# EAGLE design Qwiic_Chirp_101 (EAGLE 9.6.2)
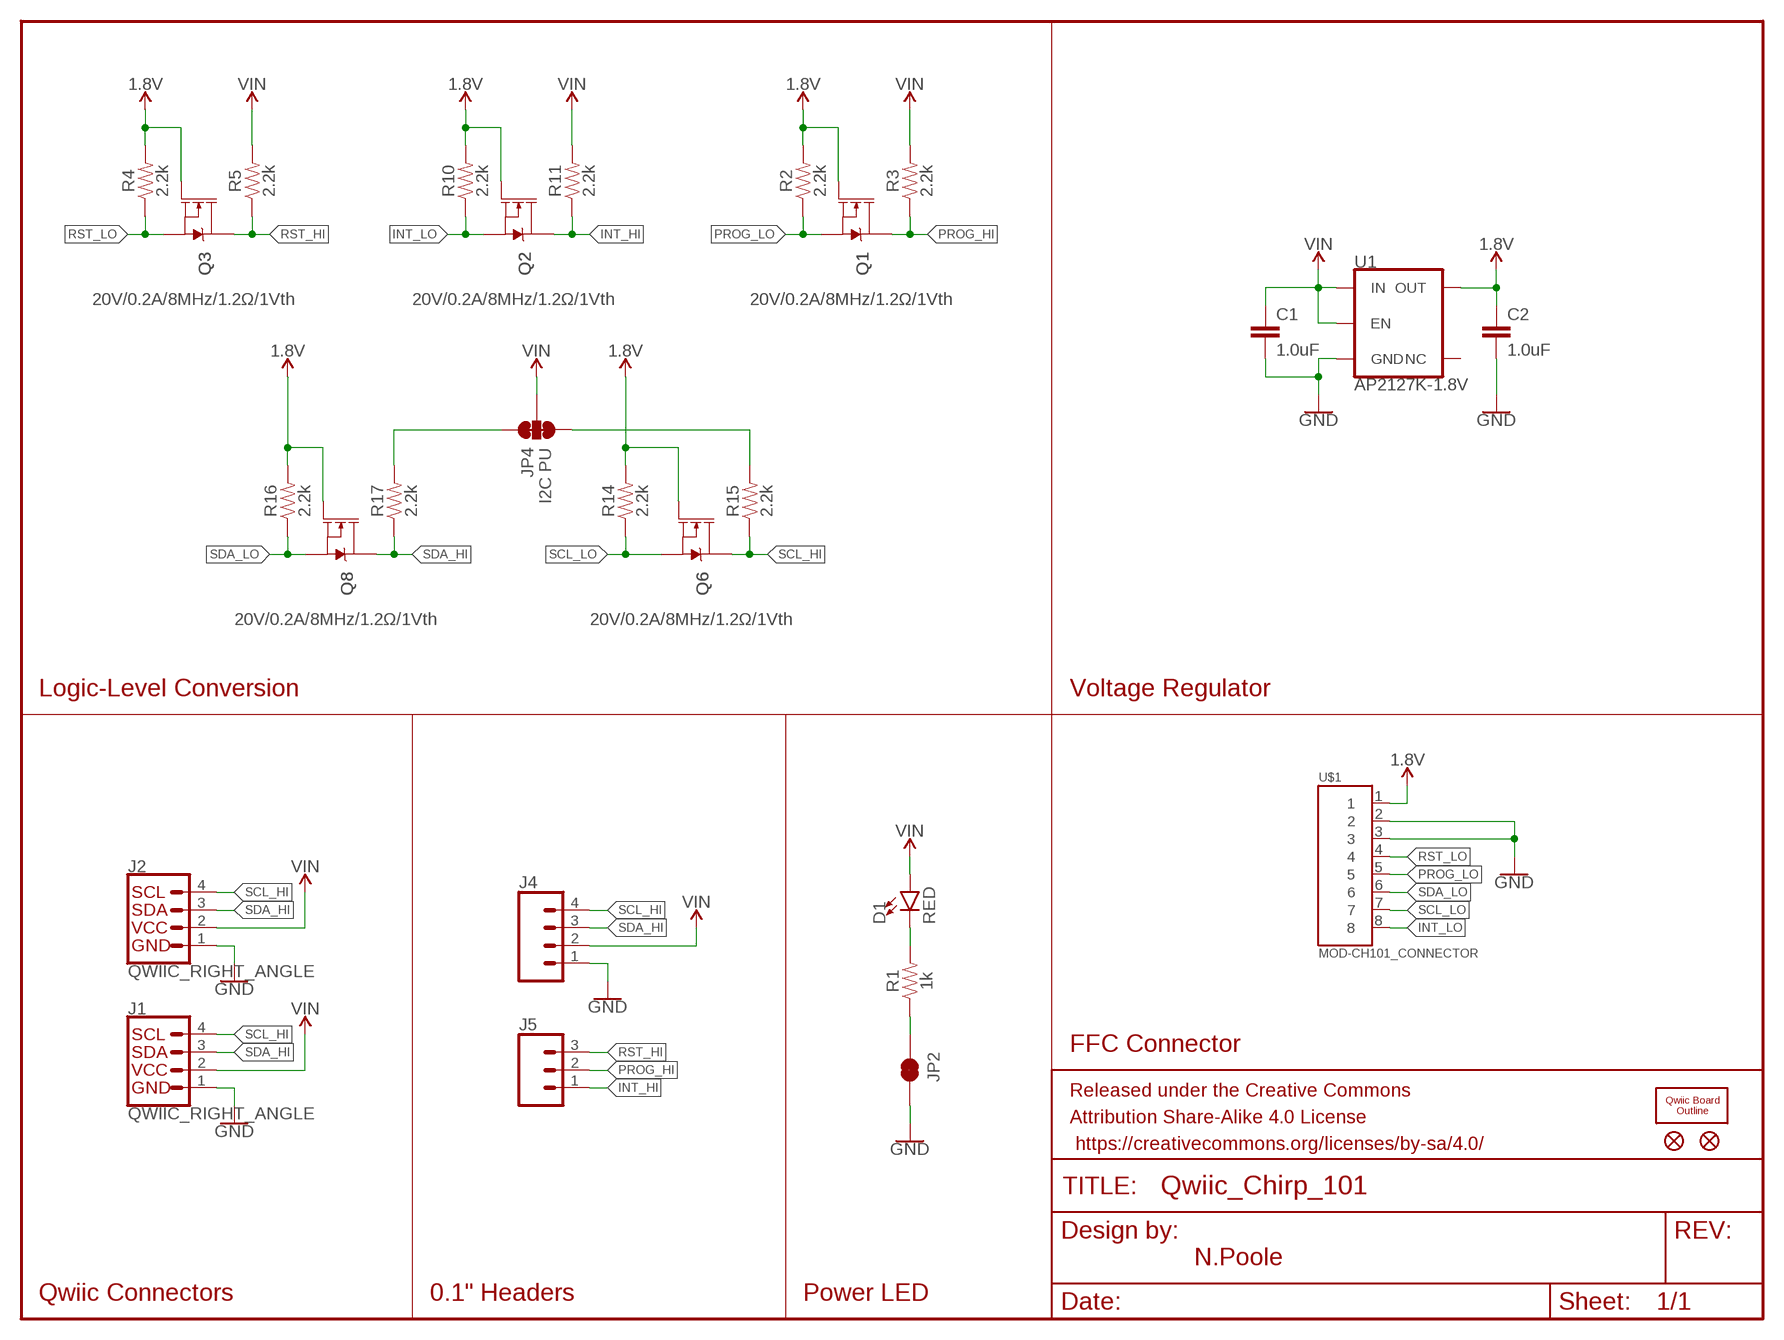
[diagram p0: schematic, sheet 1]

## Parts
C1  1.0uF  1.0UF-0603-16V-10%  [0603]
C2  1.0uF  1.0UF-0603-16V-10%  [0603]
D1  RED  LED-RED0603  [LED-0603]
FD1  FIDUCIALUFIDUCIAL  [FIDUCIAL-MICRO]
FD2  FIDUCIALUFIDUCIAL  [FIDUCIAL-MICRO]
FRAME1  FRAME-LETTERNO_PACKAGE  [DUMMY]
J1  QWIIC_RIGHT_ANGLE  QWIIC_CONNECTORJS-1MM  [JST04_1MM_RA]
J2  QWIIC_RIGHT_ANGLE  QWIIC_CONNECTORJS-1MM  [JST04_1MM_RA]
J4  CONN_041X04_NO_SILK  [1X04_NO_SILK]
J5  CONN_031X03_NO_SILK  [1X03_NO_SILK]
JP2  JUMPER-SMT_2_NC_TRACE_SILK  [SMT-JUMPER_2_NC_TRACE_SILK]
JP4  I2C PU  JUMPER-SMT_3_2-NC_TRACE_SILK  [SMT-JUMPER_3_2-NC_TRACE_SILK]
Q1  20V/0.2A/8MHz/1.2Ω/1Vth  MOSFET-NCH-RE1C002UN  [SOT-416FL]
Q2  20V/0.2A/8MHz/1.2Ω/1Vth  MOSFET-NCH-RE1C002UN  [SOT-416FL]
Q3  20V/0.2A/8MHz/1.2Ω/1Vth  MOSFET-NCH-RE1C002UN  [SOT-416FL]
Q6  20V/0.2A/8MHz/1.2Ω/1Vth  MOSFET-NCH-RE1C002UN  [SOT-416FL]
Q8  20V/0.2A/8MHz/1.2Ω/1Vth  MOSFET-NCH-RE1C002UN  [SOT-416FL]
R1  1k  1KOHM-0603-1/10W-1%  [0603]
R2  2.2k  2.2KOHM-0402T-1/16W-1%  [0402-TIGHT]
R3  2.2k  2.2KOHM-0402T-1/16W-1%  [0402-TIGHT]
R4  2.2k  2.2KOHM-0402T-1/16W-1%  [0402-TIGHT]
R5  2.2k  2.2KOHM-0402T-1/16W-1%  [0402-TIGHT]
R10  2.2k  2.2KOHM-0402T-1/16W-1%  [0402-TIGHT]
R11  2.2k  2.2KOHM-0402T-1/16W-1%  [0402-TIGHT]
R14  2.2k  2.2KOHM-0402T-1/16W-1%  [0402-TIGHT]
R15  2.2k  2.2KOHM-0402T-1/16W-1%  [0402-TIGHT]
R16  2.2k  2.2KOHM-0402T-1/16W-1%  [0402-TIGHT]
R17  2.2k  2.2KOHM-0402T-1/16W-1%  [0402-TIGHT]
U1  AP2127K-1.8V  V_REG_AP2127K-1.8V  [SOT23-5]
U$1  MOD-CH101_CONNECTOR  [FPC_MOLEX5034800800]
U$2  QWIIC_BOARD_OUTLINEH  [QWIIC_BOARD_MOUNT_HOLES]

## Nets
1.8V: C2.1 Q1.1(G) Q2.1(G) Q3.1(G) Q6.1(G) Q8.1(G) R2.2 R4.2 R10.2 R14.2 R16.2 U1.5(OUT) U$1.1
GND: C1.2 C2.2 J1.1 J2.1 J4.1 JP2.2 U1.2(GND) U$1.2 U$1.3
INT_HI: J5.1 Q2.3(D) R11.1
INT_LO: Q2.2(S) R10.1 U$1.8
N$1: D1.C R1.2
N$2: JP4.3 R15.2
N$3: JP4.1 R17.2
N$4: JP2.1 R1.1
PROG_HI: J5.2 Q1.3(D) R3.1
PROG_LO: Q1.2(S) R2.1 U$1.5
RST_HI: J5.3 Q3.3(D) R5.1
RST_LO: Q3.2(S) R4.1 U$1.4
SCL_HI: J1.4 J2.4 J4.4 Q6.3(D) R15.1
SCL_LO: Q6.2(S) R14.1 U$1.7
SDA_HI: J1.3 J2.3 J4.3 Q8.3(D) R17.1
SDA_LO: Q8.2(S) R16.1 U$1.6
VIN: C1.1 D1.A J1.2 J2.2 J4.2 JP4.2 R3.2 R5.2 R11.2 U1.1(IN) U1.3(EN)
Unconnected: U1.4(NC)

## Notes on the sheet
- Logic-Level Conversion | Voltage Regulator
- FFC Connector
- N.Poole
- Qwiic Connectors | 0.1" Headers | Power LED

## Library data of the parts
C1 C2 = SparkFun-Capacitors:1.0UF: 1µF ceramic capacitors A capacitor is a passive two-terminal electrical component used to store electrical energy temporarily in an electric field.; PROD_ID: CAP-00868
D1 = SparkFun-LED:LED-RED: Red SMD LED Used in manufacturing of most products at SparkFun Packages: 0603 - SMD 0603 package [Product Link] <http://docs.avagotech.com/docs/AV02-0551EN> 0603 SMART - SMD 0603 SMART package ( more efficient and expensive)[Product Link] <http://www.osram-os.com/Graphics/XPic2/00077099_0.pdf> 1206 - SMD1206 package [Product Link] <https://www.sparkfun.com/datasheets/DevTools/LilyPad/Q150OVS4.pdff> SparkFun Products: Pro Mini 328 -5V <https://www.sparkfun.com/products/821> RedBoard <https://www.sparkfun.com/products/12757> IOIO-OTG <https://www.sparkfun.com/products/13613>; PROD_ID: DIO-00819
FD1 FD2 = SparkFun-Aesthetics:FIDUCIAL: Fiducial Alignment Points Point-of-reference for pick-and-place machines and other optical instruments.
FRAME1 = SparkFun-Aesthetics:FRAME-LETTER: Schematic Frame - Letter Standard 8.5x11 US Letter frame; DESIGNER: Nobody; VERSION: v01
J1 J2 = SparkFun-Connectors:QWIIC_CONNECTOR: SparkFun I2C Standard Qwiic Connector An SMD 1mm pitch JST connector makes it easy and quick (get it? Qwiic?) to connect I2C devices to each other. The Qwiic system <http://www.sparkfun.com/qwiic> enables fast and solderless connection between popular platforms and various sensors and actuators. We carry 200mm <https://www.sparkfun.com/products/14204>, 100mm <https://www.sparkfun.com/products/14205>, 50mm <https://www.sparkfun.com/products/14206>, and breadboard friendly <https://www.sparkfun.com/products/14207> Qwiic cables. We also offer 10 pcs strips <https://www.sparkfun.com/products/14323> the SMD connectors.; PROD_ID: CONN-13694
J4 = SparkFun-Connectors:CONN_04: Multi connection point. Often used as Generic Header-pin footprint for 0.1 inch spaced/style header connections On any of the 0.1 inch spaced packages, you can populate with these: Break Away Headers - Straight <https://www.sparkfun.com/products/116> (PRT-00116) Break Away Male Headers - Right Angle <https://www.sparkfun.com/products/553> (PRT-00553) Female Headers <https://www.sparkfun.com/products/115> (PRT-00115) Break Away Headers - Machine Pin <https://www.sparkfun.com/products/117> (PRT-00117) Break Away Female Headers - Swiss Machine Pin <https://www.sparkfun.com/products/743> (PRT-00743) For SCREWTERMINALS and SPRING TERMINALS visit here: Screw Terimnals on SparkFun.com <https://www.sparkfun.com/search/results?term=Screw+Terminals> (5mm/3.5mm/2.54mm spacing) This device is also useful as a general connection point to wire up your design to another part of your project. Our various solder wires solder well into these plated through hole pads. Hook-Up Wire - Assortment (Stranded, 22 AWG) <https://www.sparkfun.com/products/11375> (PRT-11375) Hook-Up Wire - Assortment (Solid Core, 22 AWG) <https://www.sparkfun.com/products/11367> (PRT-11367) View the entire wire category on our website here <https://www.sparkfun.com/categories/141> Special notes: Molex polarized connector foot print use with SKU : PRT-08231 with associated crimp pins and housings. 1MM SMD Version SKU: PRT-10208; PROD_ID: CONN-09696
J5 = SparkFun-Connectors:CONN_03: Multi connection point. Often used as Generic Header-pin footprint for 0.1 inch spaced/style header connections On any of the 0.1 inch spaced packages, you can populate with these: Break Away Headers - Straight <https://www.sparkfun.com/products/116> (PRT-00116) Break Away Male Headers - Right Angle <https://www.sparkfun.com/products/553> (PRT-00553) Female Headers <https://www.sparkfun.com/products/115> (PRT-00115) Break Away Headers - Machine Pin <https://www.sparkfun.com/products/117> (PRT-00117) Break Away Female Headers - Swiss Machine Pin <https://www.sparkfun.com/products/743> (PRT-00743) Stackable Header - 3 Pin (Female, 0.1") <https://www.sparkfun.com/products/13875> (PRT-13875) For SCREWTERMINALS and SPRING TERMINALS visit here: Screw Terimnals on SparkFun.com <https://www.sparkfun.com/search/results?term=Screw+Terminals> (5mm/3.5mm/2.54mm spacing) This device is also useful as a general connection point to wire up your design to another part of your project. Our various solder wires solder well into these plated through hole pads. Hook-Up Wire - Assortment (Stranded, 22 AWG) <https://www.sparkfun.com/products/11375> (PRT-11375) Hook-Up Wire - Assortment (Solid Core, 22 AWG) <https://www.sparkfun.com/products/11367> (PRT-11367) View the entire wire category on our website here <https://www.sparkfun.com/categories/141> Special notes: Molex polarized connector foot print use with SKU : PRT-08232 with associated crimp pins and housings.
JP2 = SparkFun-Jumpers:JUMPER-SMT_2_NC_TRACE: Normally closed trace jumper This jumper has a trace between two pads so it's normally closed (NC). Use a razor knife to open the connection. For best results follow the IPC guidelines for cutting traces: Cutout at least 0.063 mm (0.005 in). Remove all loose material to clean up the cut area. Seal the cut with an approved epoxy. Reapply solder to reclose the connection.
JP4 = SparkFun-Jumpers:JUMPER-SMT_3_2-NC_TRACE: Normally closed trace jumper (2 of 2 connections) This jumper has a trace between all three pads so they are normally closed (NC). Use a razor knife to open the connection(s). For best results follow the IPC guidelines for cutting traces: Cutout at least 0.063 mm (0.005 in). Remove all loose material to clean up the cut area. Seal the cut with an approved epoxy. Reapply solder to reclose the connection(s).
Q1-Q3 Q6 Q8 = SparkFun-DiscreteSemi:MOSFET-NCH: N-channel MOSFETs Voltage controlled devices that allow control of high current outputs. SparkFun Products: SparkFun OpenScale <https://www.sparkfun.com/products/13261> SparkFun Digital Sandbox <https://www.sparkfun.com/products/12651> SparkFun Monster Moto Shield <https://www.sparkfun.com/products/10182> SparkFun MOSFET Power Controller <https://www.sparkfun.com/products/11214>; PROD_ID: TRANS_14399
R1 = SparkFun-Resistors:1KOHM: 1kΩ resistor A resistor is a passive two-terminal electrical component that implements electrical resistance as a circuit element. Resistors act to reduce current flow, and, at the same time, act to lower voltage levels within circuits. - Wikipedia; PROD_ID: RES-07856
R2-R5 R10 R11 R14-R17 = SparkFun-Resistors:2.2KOHM: 2.2kΩ resistor A resistor is a passive two-terminal electrical component that implements electrical resistance as a circuit element. Resistors act to reduce current flow, and, at the same time, act to lower voltage levels within circuits. - Wikipedia; PROD_ID: RES-14341
U1 = SparkFun-IC-Power:V_REG_AP2127: AP2127 - 300mA CMOS LDO Regulator w/ Enable The AP2127 is CMOS process low dropout linear regulator with enable function, the regulator delivers a guaranteed 300mA (min.) continuous load current. Features Output Voltage Accuracy: ±1.5% Output Current: 300mA (Min.) Foldback Short Current Protection: 50mA Enable Function to Turn ON/OFF VOUT Low Dropout Voltage (3.3V): 250mV (Typ.) @IOUT=600mA Excellent Load Regulation: 0.2%/A (Typ.) Excellent Line Regulation: 0.02%/V (Typ.) Low Quiescent Current: 55μA (Typ.) Low Standby Current: 0.01μA (Typ.) Low Output Noise: 50μVRMS PSRR: 100Hz -65dB, 1kHz -65dB OTSD Protection Stable with 1.0μF Flexible Cap: Ceramic, Tantalum and Aluminum Electrolytic Operation Temperature Range: -40°C to 85°C ESD: MM 400V, HBM 4000V; PROD_ID: VREG-14239
U$1 = SparkFun-Connectors:MOD-CH101_CONNECTOR
U$2 = SparkFun-Boards:QWIIC_BOARD_OUTLINE: Standard Outline of a Qwiic Board. Good for defining a spot on shields and board areas in which to mount a Qwiic Board.

## Board
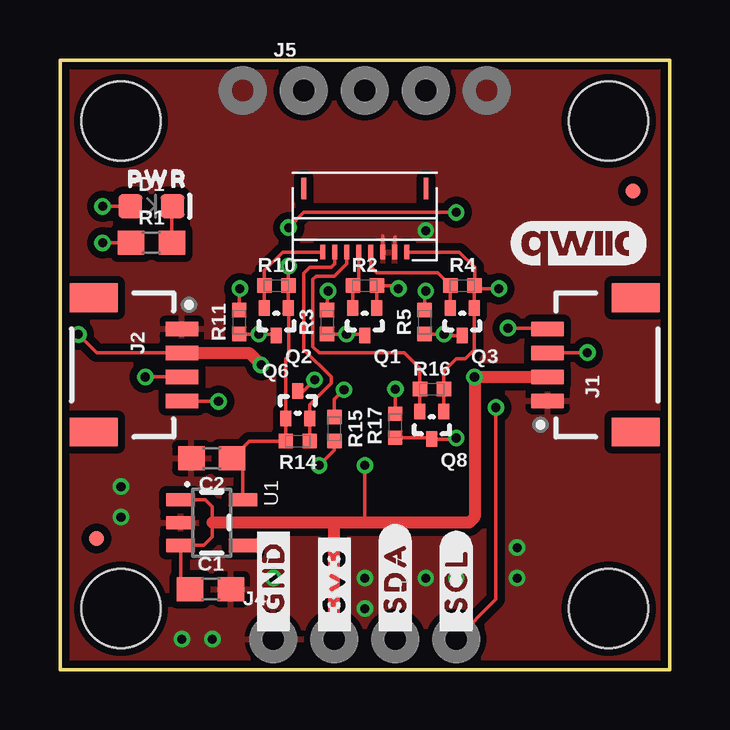
[diagram p1: board, top side]
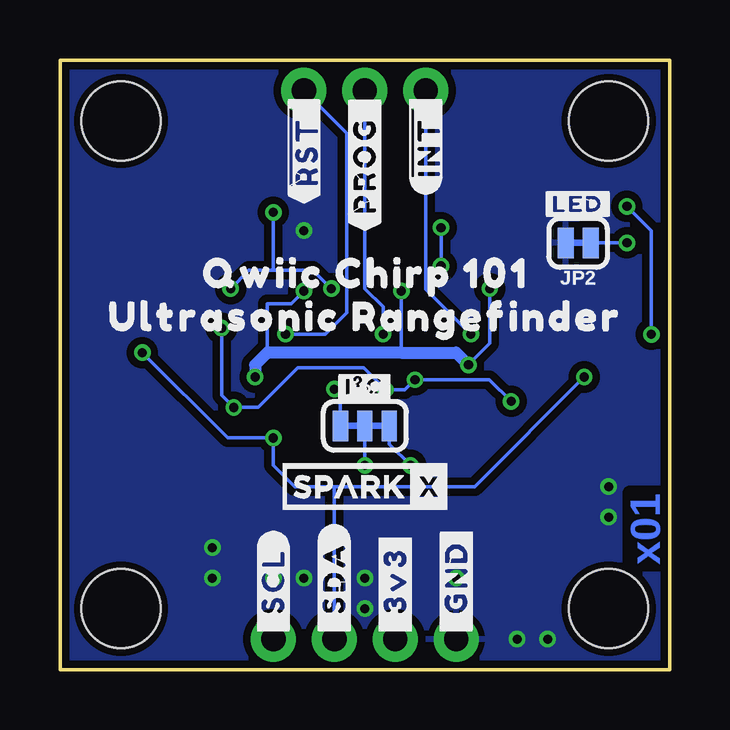
[diagram p2: board, bottom side, seen from below]

Size 25.4 x 25.4 mm. Coordinates in mm from the lower left corner, seen from the top.
Outline: 0,0 25.4,0 25.4,25.4 0,25.4 0,0
Copper layers (1*16): Top 0.035mm / dielectric 1.5mm / Bottom 0.035mm
Design rules "SparkFun-2-layer-PCBWay-LIMIT": minimum track width 6mil, minimum drill 0.3mm, track to track 6mil, track to pad 6mil, pad to pad 6mil, via to via 6mil, smd to smd 6mil, copper to edge 6mil, drill to drill 6mil, minimum pad ring 6mil, minimum via ring 6mil, stop-mask expansion 4mil, vias tented up to drill 25mil, thermal gap 10mil

### Footprints (pad centres in the part's own frame; a part is rotated, then mirrored left to right if it is on the bottom)
0603 = smd 1.1 x 1: 1 -0.85,0; 2 0.85,0
LED-0603 = smd 1 x 1: A -0.877,0; C 0.877,0
FIDUCIAL-MICRO = smd 0.635 x 0.635: 1 0,0
JST04_1MM_RA = smd 0.6 x 1.35: 1 -1.5,0; 2 -0.5,0; 3 0.5,0; 4 1.5,0 | smd 1.2 x 2: NC1 2.8,-3.675; NC2 -2.8,-3.675
1X04_NO_SILK = drill 1.016 pad 1.88: 1 0,0; 2 2.54,0; 3 5.08,0; 4 7.62,0
1X03_NO_SILK = drill 1.016 pad 1.88: 1 0,0; 2 2.54,0; 3 5.08,0
SMT-JUMPER_2_NC_TRACE_SILK = smd 0.66 x 1.27: 1 -0.521,0; 2 0.521,0
SMT-JUMPER_3_2-NC_TRACE_SILK = smd 0.635 x 1.27: 1 -1.016,0; 2 0,0; 3 1.016,0
SOT-416FL = smd 0.46 x 0.65: 1 -0.5,-1.1; 2 0.5,-1.1; 3 0,0.05
0402-TIGHT = smd 0.6 x 0.6: 1 -0.5,0; 2 0.5,0
SOT23-5 = smd 0.55 x 1.2: 1 -0.95,-1.3; 2 0,-1.3; 3 0.95,-1.3; 4 0.95,1.3; 5 -0.95,1.3
FPC_MOLEX5034800800 = smd 0.2 x 0.6: 1 -1.75,1.65; 2 -1.25,1.65; 3 -0.75,1.65; 4 -0.25,1.65; 5 0.25,1.65; 6 0.75,1.65; 7 1.25,1.65; 8 1.75,1.65 | smd 0.2 x 0.9: MNT1 -2.55,-1; MNT2 2.55,-1
QWIIC_BOARD_MOUNT_HOLES = hole 3.302: -10.16,10.16; 10.16,10.16; 10.16,-10.16; -10.16,-10.16

### Placement (x,y rotation side)
C1  6.27,3.35 0 top
C2  6.32,8.81 180 top
D1  3.81,19.3 0 top
FD1  1.52,5.46 0 top
FD2  23.88,19.94 0 top
FRAME1  0,0 0 top
J1  20.32,12.7 90 top
J2  5.08,12.7 270 top
J4  8.89,1.27 0 top
J5  10.16,24.13 0 top
JP2  3.81,17.78 180 bottom
JP4  12.7,10.16 0 bottom
Q1  12.7,13.97 180 top
Q2  9.02,13.97 180 top
Q3  16.76,13.97 180 top
Q6  9.91,11.56 0 top
Q8  15.49,9.65 180 top
R1  3.81,17.78 0 top
R2  12.7,16 0 top
R3  11.13,14.48 90 top
R4  16.76,16 0 top
R5  15.19,14.48 90 top
R10  9.02,16 0 top
R11  7.47,14.48 90 top
R14  9.91,9.53 180 top
R15  11.43,10.03 270 top
R16  15.49,11.68 0 top
R17  13.97,10.16 90 top
U1  6.32,6.12 270 top
U$1  12.7,19.05 180 top
U$2  12.7,12.7 0 top
U$3  [#_3V3#1]  11.43,1.27 90 top
U$4  [#_GND#0]  8.89,1.27 90 top
U$5  [#_SDA#2]  13.97,1.27 90 top
U$6  [#_SCL#3]  16.51,1.27 90 top
U$7  [QWIIC_CHIRP_1017]  20.32,16.51 0 bottom
U$8  [ULTRASONIC_RANGEFINDER8]  24.26,14.71 0 bottom
U$9  [#I�C#1019]  14.05,11.79 0 bottom
U$10  [#LED#1018]  5.41,19.41 0 bottom
U$11  [#_SCL#3]  16.51,1.27 90 bottom
U$12  [#_SDA#2]  13.97,1.27 90 bottom
U$13  [#_3V3#1]  11.43,1.27 90 bottom
U$14  [#_GND#0]  8.89,1.27 90 bottom
U$15  [##INT_##0]  10.16,19.81 90 bottom
U$16  [##RST_##1]  15.24,19.43 90 bottom
U$17  [#PROG_#5]  12.7,18.29 90 bottom
U$18  [SPARKX-SMALL]  12.7,7.62 0 bottom
U$19  [QWIIC_COPYRIGHT_SMALL]  21.59,17.78 0 top
U$20  [PWR0]  2.29,20.45 0 top

### Tracks (layer width: path | path; a pad name or v marks a point on that pad's centre or on a via)
1.8V  (via drill 0.38)
  Top 0.152: Q8.1 R16.2 15.99,12.44 16.51,12.95 16.89,12.95 17.26,13.33 Q3.1 R4.2 | Q1.1 R2.2 13.97,16 v14.1,15.88 | U$1.1 16.64,17.4 17.27,16.76 17.27,16.01 R4.2 | v18.29,15.88 17.39,15.88 R4.2 | v9.53,16.82 9.52,16.81 R10.2 Q2.1 9.53,13.08 9.41,12.96 Q6.1 R14.2 7.89,9.53 C2.1 7.62,8.36 U1.5 | v16.51,19.05 10.16,19.05 v9.53,18.41
  Bottom 0.152: 16.51,16.64 17.53,16.64 v18.29,15.88 | 16.51,16.64 14.86,16.64 v14.1,15.88 | v9.53,16.82 v9.53,18.41 | v16.51,19.05 16.51,16.64
GND  (via drill 0.38)
  Top 0.152: U$1.2 13.95,18.01 13.97,18.03 | U$1.3 13.45,18.07
  other vias: 15.24,18.29 12.7,3.81 12.7,2.54 19.05,5.08 19.05,3.81 15.24,3.81 16.51,3.81 2.54,7.62 2.54,6.35 5.08,1.27 6.35,1.27 8.89,3.81
  pour Top (isolate 0.305): 0,25.4 25.4,25.4 25.4,0 0,0
  pour Bottom (isolate 0.305): 0,25.4 25.4,25.4 25.4,0 0,0
INT_HI  (via drill 0.38)
  Top 0.152: Q2.3 8.96,13.98 v8.28,13.98 R11.1
  Bottom 0.152: v8.28,13.98 10.16,15.86 J5.1
INT_LO
  Top 0.152: Q2.2 R10.1 8.52,16.64 9.27,17.4 U$1.8
N$1
  Top 0.152: R1.2 4.66,19.28 D1.C
N$2  (via drill 0.38)
  Top 0.152: R15.2 11.43,9.14 v10.79,8.51
  Bottom 0.152: v10.79,8.51 11.68,9.4 JP4.3
N$3  (via drill 0.38)
  Top 0.152: R17.2 v13.97,11.68
  Bottom 0.152: v13.97,11.68 13.72,11.43 JP4.1
N$4  (via drill 0.38)
  Top 0.152: R1.1 v1.78,17.78
  Bottom 0.152: v1.78,17.78 JP2.1
PROG_HI  (via drill 0.38)
  Top 0.152: Q1.3 12.64,13.98 v11.94,13.98 R3.1
  Bottom 0.152: v11.94,13.98 11.94,15.11 12.7,15.88 J5.2
PROG_LO
  Top 0.152: Q1.2 R2.1 12.45,16.25 U$1.5
RST_HI  (via drill 0.38)
  Top 0.152: R5.1 v16,13.98 16.06,13.92 Q3.3
  Bottom 0.152: J5.3 13.46,22.35 13.46,14.86 14.34,13.98 v16,13.98
RST_LO
  Top 0.152: Q3.2 R4.1 15.73,16.53 13.21,16.53 12.95,16.79 U$1.4
SCL_HI  (via drill 0.38)
  Top 0.152: Q6.3 10.14,11.61 v10.61,12.08 | v6.6,11.18 5.1,11.18 J2.4 | R15.1 11.43,11.26 v11.83,11.66 | v18.67,14.22 20.3,14.22 J1.4 | v18.16,10.92 18.16,2.92 J4.4
  Bottom 0.152: v6.6,11.18 7.51,12.08 v10.61,12.08 11.03,11.66 v11.83,11.66 12.75,12.57 15.49,12.57 17.14,10.92 v18.16,10.92 18.67,11.43 v18.67,14.22
SCL_LO
  Top 0.152: U$1.7 11.45,16.91 11.3,16.76 10.41,16.76 10.16,16.51 10.16,13.34 11.3,12.19 11.3,11.94 10.41,11.04 Q6.2 R14.1
SDA_HI  (via drill 0.38)
  Top 0.152: R17.1 15.44,9.66 Q8.3 16.46,9.6 v16.51,9.65 | v21.97,13.21 v21.96,13.2 J1.3 | J2.3 v3.56,12.2 v3.56,12.19
  Bottom 0.152: v21.97,13.21 18.41,9.65 v16.51,9.65 16.51,8.51 15.62,7.62 13.97,7.62 | v3.56,12.19 8.13,7.62 13.97,7.62 | J4.3 13.97,7.62
SDA_LO
  Top 0.152: Q8.2 R16.1 14.99,12.56 14.35,13.21 10.79,13.21 10.54,13.46 10.54,16.26 10.67,16.38 11.43,16.38 11.95,16.9 U$1.6
VIN  (via drill 0.38)
  Top 0.152: 11.75,1.59 J4.2 | R3.2 11.12,15.72 v11.18,15.77 | R11.2 7.47,15.85 v7.49,15.88 | R5.2 15.19,15.72 v15.24,15.77 | D1.A v1.78,19.3 | J2.2 1.53,13.2 v0.76,13.97 | U1.1 5.04,7.09 6.04,7.09 6.35,6.78 6.35,6.12 6.35,5.54 5.98,5.17 U1.3 5.02,3.75 C1.1 | v12.7,8.51 12.7,6.12
  Top 0.508: J2.2 7.88,13.2 v8.38,12.7 | J1.2 v17.27,12.19 17.27,6.35 17.04,6.12 12.7,6.12 11.43,6.12 | 11.43,6.12 6.35,6.12 | J4.2 11.43,6.12
  Bottom 0.152: v7.49,15.88 7.49,13.59 v8.38,12.7 | v15.24,15.77 15.77,15.24 16.76,15.24 16.76,13.21 | 11.18,13.21 v11.18,15.77 | v0.76,13.97 0.76,18.29 v1.78,19.3 | JP4.2 v12.7,8.51
  Bottom 0.508: v8.38,12.7 8.89,13.21 11.18,13.21 16.76,13.21 17.27,12.7 v17.27,12.19

### Text on the board
Bottom: x01